# EAGLE schematic line_sensor_ver1.0 (EAGLE 6.2)
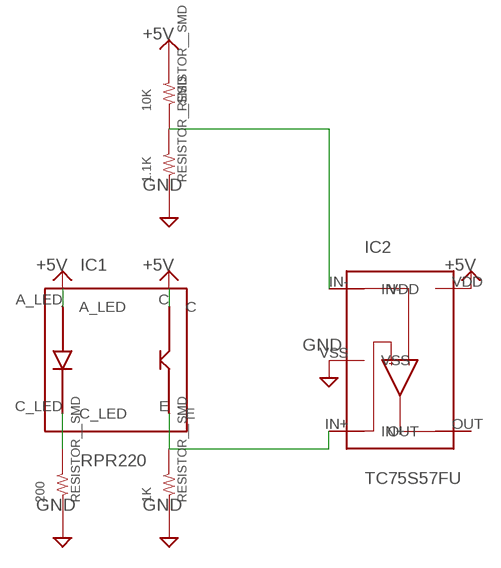
[diagram p0: schematic, sheet 1]

## Parts
1.1K  RESISTOR__SMD  [1608]
1K  RESISTOR__SMD  [1608]
10K  RESISTOR__SMD  [1608]
200  RESISTOR__SMD  [1608]
IC1  RPR220  [RPR220]
IC2  TC75S57FU  [SSOP5-P-0.65A]

## Nets
+5V: 10K.2 IC1.A_LED IC1.C IC2.VDD
GND: 1.1K.1 1K.1 200.1 IC2.VSS
N$1: 1.1K.2 10K.1 IC2.IN-
N$2: 1K.2 IC1.E IC2.IN+
N$3: 200.2 IC1.C_LED
Unconnected: IC2.OUT

## Library data of the parts
1.1K 1K 10K 200 = 01_R:RESISTOR__SMD
IC1 = 04_IC:RPR220
IC2 = 04_IC:TC75S57FU